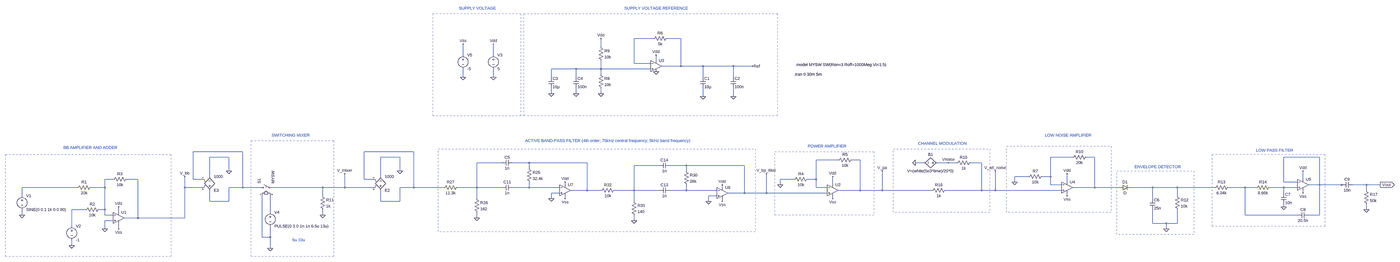
[diagram p0: schematic transceiver_with_env_detector.asc, whole sheet]
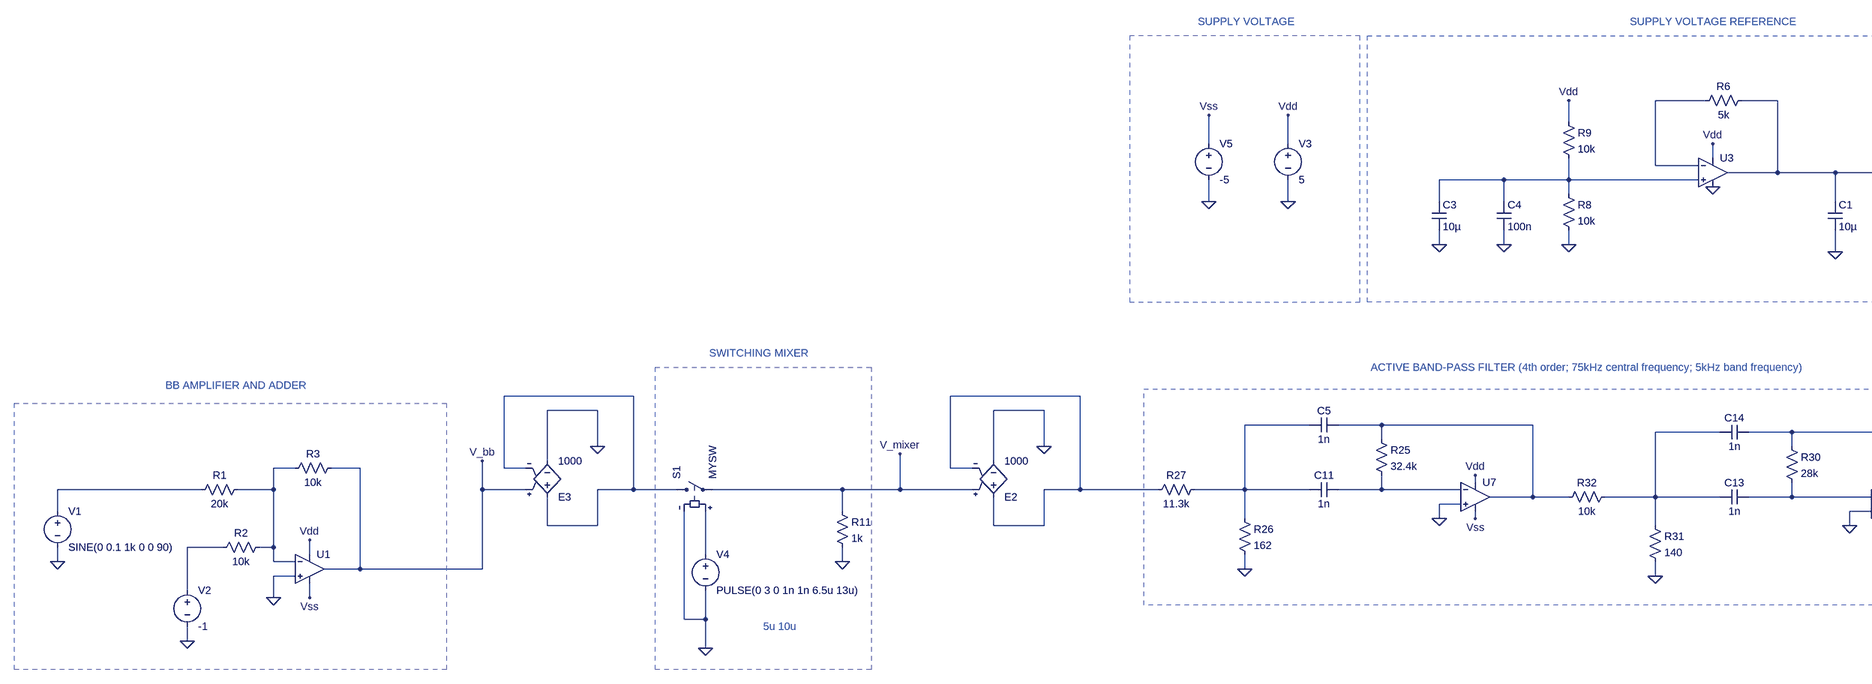
[diagram p1: schematic transceiver_with_env_detector.asc, part, row 1 of 1, column 1 of 2]
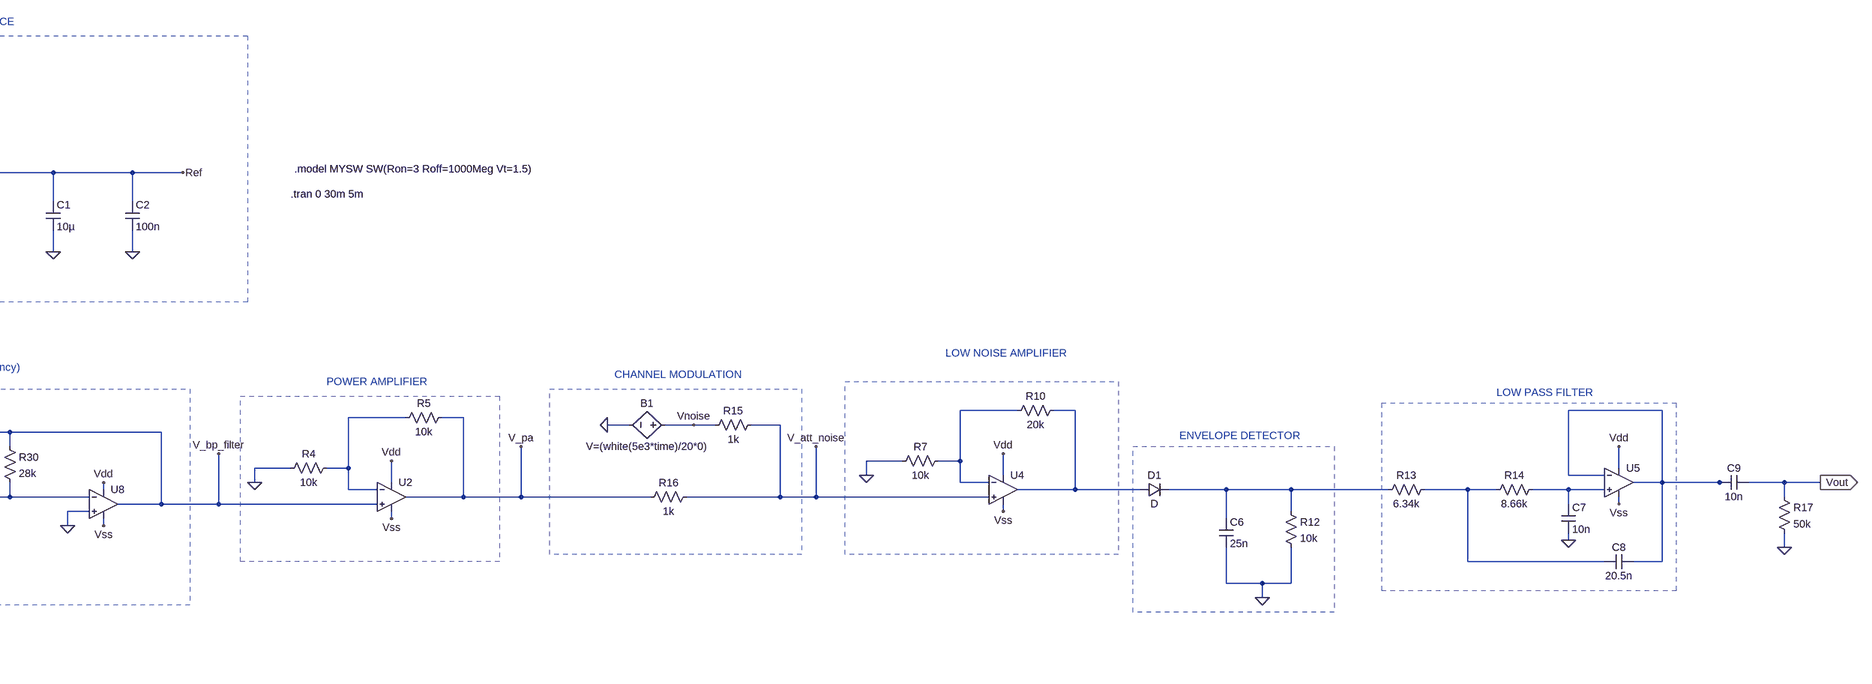
[diagram p2: schematic transceiver_with_env_detector.asc, part, row 1 of 1, column 2 of 2]
transceiver_with_env_detector.asc, the LTspice schematic file:
Version 4
SHEET 1 5896 1220
WIRE 176 -1136 64 -1136
WIRE 336 -1136 256 -1136
WIRE -128 -1088 -128 -1136
WIRE -928 -1040 -928 -1104
WIRE -752 -1040 -752 -1104
WIRE 192 -1008 192 -1040
WIRE 64 -992 64 -1136
WIRE 160 -992 64 -992
WIRE 336 -976 336 -1136
WIRE 336 -976 224 -976
WIRE 464 -976 336 -976
WIRE 640 -976 464 -976
WIRE 752 -976 640 -976
WIRE -272 -960 -416 -960
WIRE -128 -960 -128 -1008
WIRE -128 -960 -272 -960
WIRE 160 -960 -128 -960
WIRE -128 -928 -128 -960
WIRE -928 -912 -928 -960
WIRE -752 -912 -752 -960
WIRE -416 -912 -416 -960
WIRE -272 -912 -272 -960
WIRE 464 -912 464 -976
WIRE 640 -912 640 -976
WIRE -416 -816 -416 -848
WIRE -272 -816 -272 -848
WIRE -128 -816 -128 -848
WIRE 464 -800 464 -848
WIRE 640 -800 640 -848
WIRE -2208 -336 -2496 -336
WIRE -1216 -336 -1504 -336
WIRE -2288 -304 -2400 -304
WIRE -1296 -304 -1408 -304
WIRE 2608 -304 2480 -304
WIRE 2736 -304 2688 -304
WIRE 4064 -304 3856 -304
WIRE 1248 -288 1120 -288
WIRE 1376 -288 1328 -288
WIRE -704 -272 -848 -272
WIRE -544 -272 -640 -272
WIRE -208 -272 -544 -272
WIRE 1744 -272 1696 -272
WIRE 1888 -272 1824 -272
WIRE 1936 -272 1888 -272
WIRE 2080 -272 2016 -272
WIRE 208 -256 64 -256
WIRE 368 -256 272 -256
WIRE 704 -256 368 -256
WIRE -544 -240 -544 -272
WIRE -2288 -224 -2288 -304
WIRE -1296 -224 -1296 -304
WIRE 368 -224 368 -256
WIRE -2400 -192 -2400 -304
WIRE -1408 -192 -1408 -304
WIRE 2352 -192 2272 -192
WIRE 2480 -192 2480 -304
WIRE 2480 -192 2432 -192
WIRE -2960 -176 -3008 -176
WIRE -2816 -176 -2880 -176
WIRE -2496 -176 -2496 -336
WIRE -2448 -176 -2496 -176
WIRE -1504 -176 -1504 -336
WIRE -1456 -176 -1504 -176
WIRE 992 -176 912 -176
WIRE 1120 -176 1120 -288
WIRE 1120 -176 1072 -176
WIRE 3968 -176 3968 -224
WIRE 2272 -160 2272 -192
WIRE 2576 -160 2576 -208
WIRE 3856 -160 3856 -304
WIRE 3936 -160 3856 -160
WIRE -336 -144 -336 -160
WIRE 912 -144 912 -176
WIRE 1216 -144 1216 -192
WIRE 2480 -144 2480 -192
WIRE 2544 -144 2480 -144
WIRE 4064 -144 4064 -304
WIRE 4064 -144 4000 -144
WIRE 4192 -144 4064 -144
WIRE 4208 -144 4192 -144
WIRE 4336 -144 4256 -144
WIRE 4416 -144 4336 -144
WIRE -3168 -128 -3488 -128
WIRE -3008 -128 -3008 -176
WIRE -3008 -128 -3088 -128
WIRE -2544 -128 -2544 -192
WIRE -2448 -128 -2544 -128
WIRE -2208 -128 -2208 -336
WIRE -2208 -128 -2288 -128
WIRE -2112 -128 -2208 -128
WIRE -1744 -128 -2032 -128
WIRE -1616 -128 -1616 -208
WIRE -1616 -128 -1744 -128
WIRE -1456 -128 -1616 -128
WIRE -1216 -128 -1216 -336
WIRE -1216 -128 -1296 -128
WIRE -1040 -128 -1216 -128
WIRE -848 -128 -848 -272
WIRE -848 -128 -960 -128
WIRE -704 -128 -848 -128
WIRE -544 -128 -544 -160
WIRE -544 -128 -640 -128
WIRE -368 -128 -544 -128
WIRE 576 -128 576 -144
WIRE 1120 -128 1120 -176
WIRE 1184 -128 1120 -128
WIRE 2736 -128 2736 -304
WIRE 2736 -128 2608 -128
WIRE 2880 -128 2736 -128
WIRE 3072 -128 2944 -128
WIRE 3216 -128 3072 -128
WIRE 3456 -128 3216 -128
WIRE 3632 -128 3536 -128
WIRE 3696 -128 3632 -128
WIRE 3856 -128 3776 -128
WIRE 3936 -128 3856 -128
WIRE -208 -112 -208 -272
WIRE -208 -112 -304 -112
WIRE -128 -112 -208 -112
WIRE 64 -112 64 -256
WIRE 64 -112 -48 -112
WIRE 208 -112 64 -112
WIRE 368 -112 368 -144
WIRE 368 -112 272 -112
WIRE 544 -112 368 -112
WIRE 1376 -112 1376 -288
WIRE 1376 -112 1248 -112
WIRE 1504 -112 1504 -224
WIRE 1504 -112 1376 -112
WIRE 1792 -112 1504 -112
WIRE 2080 -112 2080 -272
WIRE 2080 -112 1872 -112
WIRE 2160 -112 2160 -224
WIRE 2160 -112 2080 -112
WIRE 2544 -112 2160 -112
WIRE 4336 -112 4336 -144
WIRE -368 -96 -416 -96
WIRE 704 -96 704 -256
WIRE 704 -96 608 -96
WIRE 832 -96 832 -208
WIRE 832 -96 704 -96
WIRE 1184 -96 832 -96
WIRE 3856 -96 3856 -128
WIRE 3968 -96 3968 -112
WIRE -3488 -80 -3488 -128
WIRE -1744 -80 -1744 -128
WIRE 544 -80 496 -80
WIRE 2576 -80 2576 -96
WIRE 3216 -80 3216 -128
WIRE -848 -64 -848 -128
WIRE -416 -64 -416 -96
WIRE -336 -64 -336 -80
WIRE 1216 -64 1216 -80
WIRE 3072 -64 3072 -128
WIRE -2400 -48 -2400 -112
WIRE -2288 -48 -2288 -128
WIRE -2288 -48 -2400 -48
WIRE -1408 -48 -1408 -112
WIRE -1296 -48 -1296 -128
WIRE -1296 -48 -1408 -48
WIRE 64 -48 64 -112
WIRE 496 -48 496 -80
WIRE 576 -48 576 -64
WIRE 3856 -16 3856 -32
WIRE -3120 0 -3200 0
WIRE -3008 0 -3008 -128
WIRE -3008 0 -3040 0
WIRE 4336 0 4336 -32
WIRE -2928 16 -2928 -16
WIRE -2048 16 -2048 -80
WIRE -3488 32 -3488 0
WIRE -3008 32 -3008 0
WIRE -2960 32 -3008 32
WIRE -1744 32 -1744 0
WIRE 3632 32 3632 -128
WIRE 3936 32 3632 32
WIRE 4064 32 4064 -144
WIRE 4064 32 4000 32
WIRE -2816 48 -2816 -176
WIRE -2816 48 -2896 48
WIRE -2544 48 -2544 -128
WIRE -2544 48 -2816 48
WIRE -848 48 -848 16
WIRE -2960 64 -3008 64
WIRE 64 64 64 32
WIRE 3072 80 3072 0
WIRE 3152 80 3072 80
WIRE 3216 80 3216 0
WIRE 3216 80 3152 80
WIRE -3200 96 -3200 0
WIRE -3008 112 -3008 64
WIRE -2928 112 -2928 80
WIRE 3152 112 3152 80
WIRE -2096 160 -2096 -80
WIRE -2048 160 -2048 96
WIRE -2048 160 -2096 160
WIRE -3200 208 -3200 176
WIRE -2048 224 -2048 160
FLAG -3488 32 0
FLAG -3200 208 0
FLAG -3008 112 0
FLAG -752 -1104 Vdd
FLAG -752 -912 0
FLAG 912 -144 0
FLAG 1216 -192 Vdd
FLAG -2048 224 0
FLAG 464 -800 0
FLAG 640 -800 0
FLAG 192 -944 0
FLAG -416 -816 0
FLAG -272 -816 0
FLAG -128 -816 0
FLAG -128 -1136 Vdd
FLAG 752 -976 Ref
FLAG 192 -1040 Vdd
FLAG -336 -160 Vdd
FLAG 576 -144 Vdd
FLAG -2544 -192 V_bb
FLAG -1616 -208 V_mixer
FLAG -928 -912 0
FLAG -928 -1104 Vss
FLAG -336 -64 Vss
FLAG 576 -48 Vss
FLAG 1216 -64 Vss
FLAG 2272 -160 0
FLAG 2576 -208 Vdd
FLAG 2576 -80 Vss
FLAG -1296 -224 0
FLAG -416 -64 0
FLAG 496 -48 0
FLAG -848 48 0
FLAG 64 64 0
FLAG -2288 -224 0
FLAG -1744 32 0
FLAG 3152 112 0
FLAG 3968 -224 Vdd
FLAG 3968 -96 Vss
FLAG 3856 -16 0
FLAG -2928 -16 Vdd
FLAG -2928 112 Vss
FLAG 1696 -272 0
FLAG 1888 -272 Vnoise
FLAG 832 -208 V_bp_filter
FLAG 1504 -224 V_pa
FLAG 2160 -224 V_att_noise
FLAG 4336 0 0
FLAG 4416 -144 Vout
IOPIN 4416 -144 Out
SYMBOL voltage -3488 -96 R0
WINDOW 123 0 0 Left 0
WINDOW 39 0 0 Left 0
SYMATTR InstName V1
SYMATTR Value SINE(0 0.1 1k 0 0 90)
SYMBOL res -3072 -144 R90
WINDOW 0 0 56 VBottom 2
WINDOW 3 32 56 VTop 2
SYMATTR InstName R1
SYMATTR Value 20k
SYMBOL res -3024 -16 R90
WINDOW 0 0 56 VBottom 2
WINDOW 3 32 56 VTop 2
SYMATTR InstName R2
SYMATTR Value 10k
SYMBOL res -2864 -192 R90
WINDOW 0 0 56 VBottom 2
WINDOW 3 32 56 VTop 2
SYMATTR InstName R3
SYMATTR Value 10k
SYMBOL OpAmps\\UniversalOpAmp2 1216 -112 R0
SYMATTR InstName U2
SYMBOL voltage -752 -1056 R0
WINDOW 123 0 0 Left 0
WINDOW 39 0 0 Left 0
SYMATTR InstName V3
SYMATTR Value 5
SYMBOL res 1088 -192 R90
WINDOW 0 0 56 VBottom 2
WINDOW 3 32 56 VTop 2
SYMATTR InstName R4
SYMATTR Value 10k
SYMBOL res 1344 -304 R90
WINDOW 0 0 56 VBottom 2
WINDOW 3 32 56 VTop 2
SYMATTR InstName R5
SYMATTR Value 10k
SYMBOL sw -2128 -128 R270
SYMATTR InstName S1
SYMATTR Value MYSW
SYMBOL voltage -2048 0 R0
WINDOW 123 0 0 Left 0
WINDOW 39 0 0 Left 0
SYMATTR InstName V4
SYMATTR Value PULSE(0 3 0 1n 1n 6.5u 13u)
SYMBOL OpAmps\\UniversalOpAmp2 192 -976 R0
SYMATTR InstName U3
SYMBOL res 272 -1152 R90
WINDOW 0 0 56 VBottom 2
WINDOW 3 32 56 VTop 2
SYMATTR InstName R6
SYMATTR Value 5k
SYMBOL cap 448 -912 R0
SYMATTR InstName C1
SYMATTR Value 10µ
SYMBOL cap 624 -912 R0
SYMATTR InstName C2
SYMATTR Value 100n
SYMBOL res -144 -944 R0
SYMATTR InstName R8
SYMATTR Value 10k
SYMBOL res -144 -1104 R0
SYMATTR InstName R9
SYMATTR Value 10k
SYMBOL cap -432 -912 R0
SYMATTR InstName C3
SYMATTR Value 10µ
SYMBOL cap -288 -912 R0
SYMATTR InstName C4
SYMATTR Value 100n
SYMBOL OpAmps\\UniversalOpAmp2 -336 -112 R0
SYMATTR InstName U7
SYMBOL cap -640 -144 R90
WINDOW 0 0 32 VBottom 2
WINDOW 3 32 32 VTop 2
SYMATTR InstName C11
SYMATTR Value 1n
SYMBOL res -560 -256 R0
SYMATTR InstName R25
SYMATTR Value 32.4k
SYMBOL res -864 -80 R0
SYMATTR InstName R26
SYMATTR Value 162
SYMBOL res -944 -144 R90
WINDOW 0 0 56 VBottom 2
WINDOW 3 32 56 VTop 2
SYMATTR InstName R27
SYMATTR Value 11.3k
SYMBOL OpAmps\\UniversalOpAmp2 576 -96 R0
SYMATTR InstName U8
SYMBOL cap 272 -128 R90
WINDOW 0 0 32 VBottom 2
WINDOW 3 32 32 VTop 2
SYMATTR InstName C13
SYMATTR Value 1n
SYMBOL cap 272 -272 R90
WINDOW 0 0 32 VBottom 2
WINDOW 3 32 32 VTop 2
SYMATTR InstName C14
SYMATTR Value 1n
SYMBOL res 352 -240 R0
SYMATTR InstName R30
SYMATTR Value 28k
SYMBOL res 48 -64 R0
SYMATTR InstName R31
SYMATTR Value 140
SYMBOL res -32 -128 R90
WINDOW 0 0 56 VBottom 2
WINDOW 3 32 56 VTop 2
SYMATTR InstName R32
SYMATTR Value 10k
SYMBOL voltage -928 -1056 R0
WINDOW 123 0 0 Left 0
WINDOW 39 0 0 Left 0
SYMATTR InstName V5
SYMATTR Value -5
SYMBOL voltage -3200 80 R0
WINDOW 123 0 0 Left 0
WINDOW 39 0 0 Left 0
SYMATTR InstName V2
SYMATTR Value -1
SYMBOL OpAmps\\UniversalOpAmp2 2576 -128 R0
SYMATTR InstName U4
SYMBOL res 2448 -208 R90
WINDOW 0 0 56 VBottom 2
WINDOW 3 32 56 VTop 2
SYMATTR InstName R7
SYMATTR Value 10k
SYMBOL res 2704 -320 R90
WINDOW 0 0 56 VBottom 2
WINDOW 3 32 56 VTop 2
SYMATTR InstName R10
SYMATTR Value 20k
SYMBOL e -1408 -96 M180
SYMATTR InstName E2
SYMATTR Value 1000
SYMBOL e -2400 -96 M180
SYMATTR InstName E3
SYMATTR Value 1000
SYMBOL res -1760 -96 R0
SYMATTR InstName R11
SYMATTR Value 1k
SYMBOL cap -640 -288 R90
WINDOW 0 0 32 VBottom 2
WINDOW 3 32 32 VTop 2
SYMATTR InstName C5
SYMATTR Value 1n
SYMBOL cap 3056 -64 R0
SYMATTR InstName C6
SYMATTR Value 25n
SYMBOL res 3200 -96 R0
SYMATTR InstName R12
SYMATTR Value 10k
SYMBOL res 3552 -144 R90
WINDOW 0 0 56 VBottom 2
WINDOW 3 32 56 VTop 2
SYMATTR InstName R13
SYMATTR Value 6.34k
SYMBOL res 3792 -144 R90
WINDOW 0 0 56 VBottom 2
WINDOW 3 32 56 VTop 2
SYMATTR InstName R14
SYMATTR Value 8.66k
SYMBOL OpAmps\\UniversalOpAmp2 3968 -144 R0
SYMATTR InstName U5
SYMBOL cap 3840 -96 R0
SYMATTR InstName C7
SYMATTR Value 10n
SYMBOL cap 4000 16 R90
WINDOW 0 0 32 VBottom 2
WINDOW 3 32 32 VTop 2
SYMATTR InstName C8
SYMATTR Value 20.5n
SYMBOL diode 2880 -112 R270
WINDOW 0 32 32 VTop 2
WINDOW 3 0 32 VBottom 2
SYMATTR InstName D1
SYMBOL OpAmps\\UniversalOpAmp2 -2928 48 R0
SYMATTR InstName U1
SYMBOL res 2032 -288 R90
WINDOW 0 0 56 VBottom 2
WINDOW 3 32 56 VTop 2
SYMATTR InstName R15
SYMATTR Value 1k
SYMBOL res 1888 -128 R90
WINDOW 0 0 56 VBottom 2
WINDOW 3 32 56 VTop 2
SYMATTR InstName R16
SYMATTR Value 1k
SYMBOL bv 1840 -272 R90
WINDOW 0 -32 56 VBottom 2
WINDOW 3 32 56 VTop 2
SYMATTR InstName B1
SYMATTR Value V=(white(5e3*time)/20*0)
SYMBOL cap 4256 -160 R90
WINDOW 0 0 32 VBottom 2
WINDOW 3 32 32 VTop 2
SYMATTR InstName C9
SYMATTR Value 10n
SYMBOL res 4320 -128 R0
SYMATTR InstName R17
SYMATTR Value 50k
TEXT 992 -928 Left 2 !.tran 0 30m 5m
TEXT 1000 -984 Left 2 !.model MYSW SW(Ron=3 Roff=1000Meg Vt=1.5)
TEXT 8 -1312 Left 2 ;SUPPLY VOLTAGE REFERENCE
TEXT -568 -400 Left 2 ;ACTIVE BAND-PASS FILTER (4th order; 75kHz central frequency; 5kHz band frequency)
TEXT -952 -1312 Left 2 ;SUPPLY VOLTAGE
TEXT -2040 -432 Left 2 ;SWITCHING MIXER
TEXT -3248 -360 Left 2 ;BB AMPLIFIER AND ADDER
TEXT 1072 -368 Left 2 ;POWER AMPLIFIER
TEXT -1920 176 Left 2 ;5u 10u
TEXT 2448 -432 Left 2 ;LOW NOISE AMPLIFIER
TEXT 2968 -248 Left 2 ;ENVELOPE DETECTOR
TEXT 3696 -344 Left 2 ;LOW PASS FILTER
TEXT 1712 -384 Left 2 ;CHANNEL MODULATION
RECTANGLE Normal 896 -688 -576 -1280 2
RECTANGLE Normal -1104 -688 -592 -1280 2
RECTANGLE Normal -2624 272 -3584 -320 2
RECTANGLE Normal -1680 272 -2160 -400 2
RECTANGLE Normal 1456 32 880 -336 2
RECTANGLE Normal 2128 16 1568 -352 2
RECTANGLE Normal 2832 16 2224 -368 2
RECTANGLE Normal 3312 144 2864 -224 2
RECTANGLE Normal 768 128 -1072 -352 2
RECTANGLE Normal 3440 96 4096 -320 2

The netlist it stands for:
* transceiver_with_env_detector.asc
V1 N013 0 SINE(0 0.1 1k 0 0 90)
R1 N012 N013 20k
R2 N012 N019 10k
R3 V_bb N012 10k
XU2 V_bp_filter N008 Vdd Vss V_pa level2 Avol=1Meg GBW=10Meg Slew=10Meg Ilimit=25m Rail=0 Vos=0 En=0 Enk=0 In=0 Ink=0 Rin=500Meg  ; pins In+ In- V+ V- OUT
V3 Vdd 0 5
R4 N008 0 10k
R5 V_pa N008 10k
S1 N003 V_mixer N020 0 MYSW
V4 N020 0 PULSE(0 3 0 1n 1n 6.5u 13u)
XU3 N002 N001 Vdd 0 Ref level2 Avol=1Meg GBW=10Meg Slew=10Meg Ilimit=25m Rail=0 Vos=0 En=0 Enk=0 In=0 Ink=0 Rin=500Meg  ; pins In+ In- V+ V- OUT
R6 Ref N001 5k
C1 Ref 0 10µ
C2 Ref 0 100n
R8 N002 0 10k
R9 Vdd N002 10k
C3 N002 0 10µ
C4 N002 0 100n
XU7 0 N014 Vdd Vss N010 level2 Avol=1Meg GBW=10Meg Slew=10Meg Ilimit=25m Rail=0 Vos=0 En=0 Enk=0 In=0 Ink=0 Rin=500Meg  ; pins In+ In- V+ V- OUT
C11 N014 N009 1n
R25 N010 N014 32.4k
R26 N009 0 162
R27 N009 N004 11.3k
XU8 0 N018 Vdd Vss V_bp_filter level2 Avol=1Meg GBW=10Meg Slew=10Meg Ilimit=25m Rail=0 Vos=0 En=0 Enk=0 In=0 Ink=0 Rin=500Meg  ; pins In+ In- V+ V- OUT
C13 N018 N011 1n
C14 V_bp_filter N011 1n
R30 V_bp_filter N018 28k
R31 N011 0 140
R32 N011 N010 10k
V5 Vss 0 -5
V2 N019 0 -1
XU4 V_att_noise N005 Vdd Vss N006 level2 Avol=1Meg GBW=10Meg Slew=10Meg Ilimit=25m Rail=0 Vos=0 En=0 Enk=0 In=0 Ink=0 Rin=500Meg  ; pins In+ In- V+ V- OUT
R7 N005 0 10k
R10 N006 N005 20k
E2 N004 0 V_mixer N004 1000
E3 N003 0 V_bb N003 1000
R11 V_mixer 0 1k
C5 N010 N009 1n
C6 N015 0 25n
R12 N015 0 10k
R13 N016 N015 6.34k
R14 N017 N016 8.66k
XU5 N017 N007 Vdd Vss N007 level2 Avol=1Meg GBW=10Meg Slew=10Meg Ilimit=25m Rail=0 Vos=0 En=0 Enk=0 In=0 Ink=0 Rin=500Meg  ; pins In+ In- V+ V- OUT
C7 N017 0 10n
C8 N007 N016 20.5n
D1 N006 N015 D
XU1 0 N012 Vdd Vss V_bb level2 Avol=1Meg GBW=10Meg Slew=10Meg Ilimit=25m Rail=0 Vos=0 En=0 Enk=0 In=0 Ink=0 Rin=500Meg  ; pins In+ In- V+ V- OUT
R15 V_att_noise Vnoise 1k
R16 V_att_noise V_pa 1k
B1 Vnoise 0 V=(white(5e3*time)/20*0)
C9 Vout N007 10n
R17 Vout 0 50k
.model D D
.lib standard.dio
.tran 0 30m 5m
.model MYSW SW(Ron=3 Roff=1000Meg Vt=1.5)
* SUPPLY VOLTAGE REFERENCE
* ACTIVE BAND-PASS FILTER (4th order; 75kHz central frequency; 5kHz band frequency)
* SUPPLY VOLTAGE
* SWITCHING MIXER
* BB AMPLIFIER AND ADDER
* POWER AMPLIFIER
* 5u 10u
* LOW NOISE AMPLIFIER
* ENVELOPE DETECTOR
* LOW PASS FILTER
* CHANNEL MODULATION
.lib UniversalOpAmp2.lib
.backanno
.end